# Altium schematic sheet Sheet2.SchDoc
size A
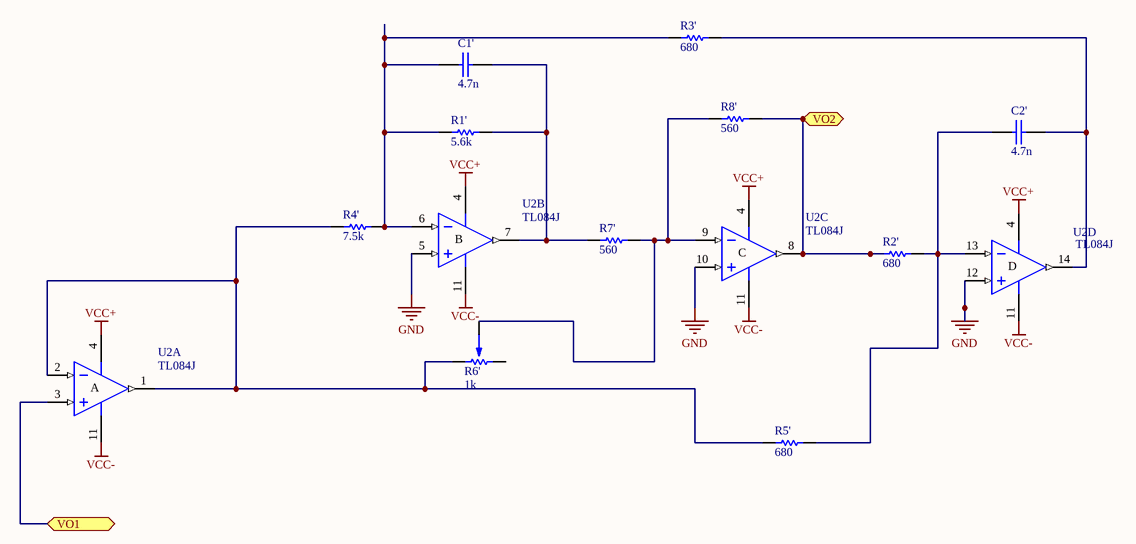
[diagram p0: Sheet2.SchDoc]

## Parts
C1'  4.7n  [CAP100]
C2'  4.7n  [CAP100]
R1'  5.6k  [0805]
R2'  680  [0805]
R3'  680  [0805]
R4'  7.5k  [0805]
R5'  680  [0805]
R6'  1k  [PRESET V]
R7'  560  [0805]
R8'  560  [0805]
U2  TL084J  [J014]  (parts A,B,C,D of 4)

## Ports
VO1, VO2

## Nets
GND: U2.5(IN+) U2.10(IN+) U2.12(IN+)
VCC+: U2.4(V+)
VCC-: U2.11(V-)
VO1: U2.3(IN+) ; port VO1
VO2: R2'.1 R8'.2 U2.8(OUT) ; port VO2
NetC1'_1: C1'.1 R1'.1 R3'.1 R4'.2 U2.6(IN-)
NetC1'_2: C1'.2 R1'.2 R7'.1 U2.7(OUT)
NetC2'_1: C2'.1 R2'.2 R5'.2 U2.13(IN-)
NetC2'_2: C2'.2 R3'.2 U2.14(OUT)
NetR4'_1: R4'.1 R5'.1 R6'.1 U2.1(OUT) U2.2(IN-)
NetR6'_2: R6'.2 R7'.2 R8'.1 U2.9(IN-)

Not connected (* = marked no-connect by the designer): R6' 3

## Notes on the sheet
- (in symbol TL084J, part A) A
- (in symbol TL084J, part B) B
- (in symbol TL084J, part C) C
- (in symbol TL084J, part D) D

## Library data of the parts
C1' C2' = CAP
R1' R2' R3' R4' R5' R7' R8' = RES
R6' = PRESET
U2 = TL084J: JFET-Input Operational Amplifier; Published: 16-Jan-2001; LatestRevisionDate: 04-Mar-2005; LatestRevisionNote: Stylized 3D Model Added.; DatasheetVersion: Feb-1999; PackageVersion: Jun-1999; PackageReference: J014; Publisher: Altium Limited; PackageDescription: DIP; 14 Leads; Row Spacing 7.62 mm; Pitch 2.54 mm; ComponentLink1Description: Manufacturer Link; ComponentLink1URL: http://www.ti.com/; ComponentLink2Description: Datasheet; ComponentLink2URL: http://www-s.ti.com/sc/ds/tl084.pdf